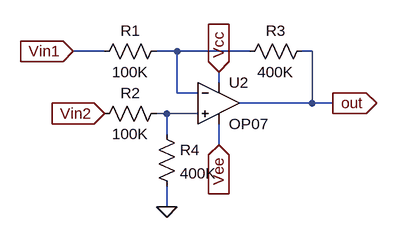
[diagram p0: schematic substructor.asc]
substructor.asc, the LTspice schematic file:
Version 4
SHEET 1 888 680
WIRE 112 32 64 32
WIRE 224 32 192 32
WIRE 336 32 224 32
WIRE 432 32 416 32
WIRE 288 80 288 64
WIRE 224 96 224 32
WIRE 256 96 224 96
WIRE 432 112 432 32
WIRE 432 112 320 112
WIRE 464 112 432 112
WIRE 208 128 192 128
WIRE 256 128 208 128
WIRE 208 160 208 128
WIRE 288 176 288 144
WIRE 208 272 208 240
FLAG 288 176 Vee
IOPIN 288 176 In
FLAG 288 64 Vcc
IOPIN 288 64 In
FLAG 464 112 out
IOPIN 464 112 Out
FLAG 208 272 0
FLAG 112 128 Vin2
IOPIN 112 128 In
FLAG 64 32 Vin1
IOPIN 64 32 In
SYMBOL res 208 16 R90
WINDOW 0 0 56 VBottom 2
WINDOW 3 32 56 VTop 2
SYMATTR InstName R1
SYMATTR Value 100K
SYMBOL res 208 112 R90
WINDOW 0 0 56 VBottom 2
WINDOW 3 32 56 VTop 2
SYMATTR InstName R2
SYMATTR Value 100K
SYMBOL res 432 16 R90
WINDOW 0 0 56 VBottom 2
WINDOW 3 32 56 VTop 2
SYMATTR InstName R3
SYMATTR Value 400K
SYMBOL res 192 144 R0
SYMATTR InstName R4
SYMATTR Value 400K
SYMBOL OpAmps\\OP07 288 48 R0
SYMATTR InstName U2

The netlist it stands for:
* substructor.asc
R1 N001 Vin1 100K
R2 N002 Vin2 100K
R3 out N001 400K
R4 N002 0 400K
XU2 N002 N001 Vcc Vee out LT1001  ; OP07, pins In+ In- V+ V- OUT
.lib LTC.lib
.backanno
.end